# Altium schematic sheet Communication.SchDoc
size A; SheetNumber: 4; SheetTotal: 5; SPICEModelCacheJQVSSVKU: <root> / <DocumentId>JQVSSVKU</DocumentId> / </root>
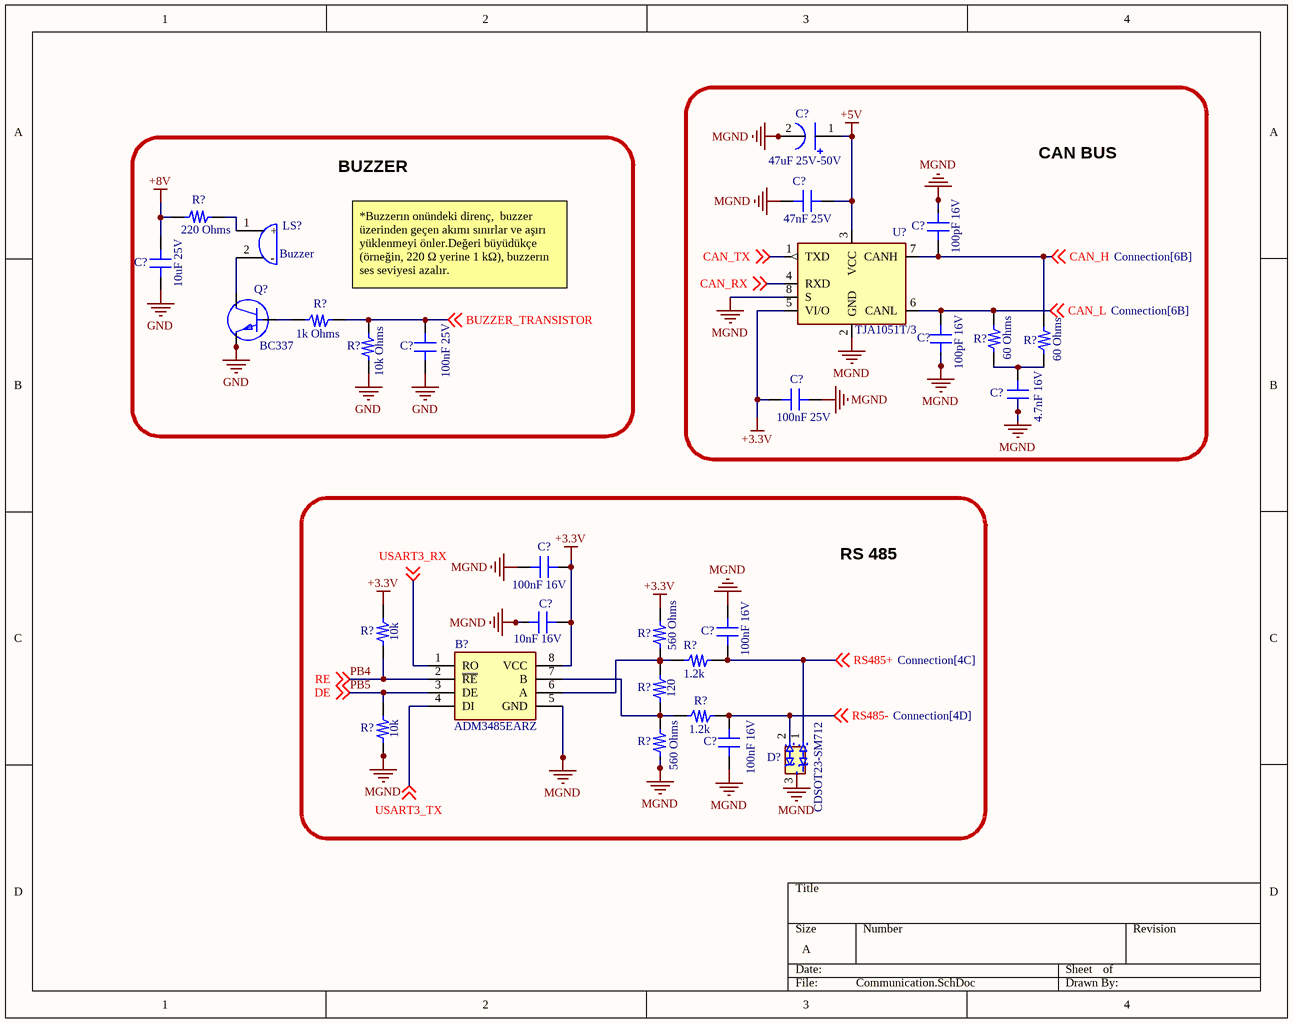
[diagram p0: Communication.SchDoc]

## Parts
(Parts that share a designator on the sheet are numbered #1, #2 ... from top to bottom, then left to right.)
B?  ADM3485EARZ  [SOIC127P600X175-8N]
C?#1  47uF 25V-50V  [Cap 18uF 63V]
C?#2  47nF 25V  [0603_CAP]
C?#3  100pF 16V  [0603_CAP]
C?#4  10uF 25V  [0805_CAP]
C?#5  100pF 16V  [0603_CAP]
C?#6  100nF 25V  [0603_CAP]
C?#7  4.7nF 16V  [0603_CAP]
C?#8  100nF 25V  [0603_CAP]
C?#9  100nF 16V  [0603_CAP]
C?#10  100nF 16V  [0603_CAP]
C?#11  10nF 16V  [0603_CAP]
C?#12  100nF 16V  [0603_CAP]
D?  CDSOT23-SM712  [SOT95P230X117-3N]
LS?  Buzzer  [Buzzer 300Mil Pitch]
Q?  BC337  [TO-92R]
R?#1  220 Ohms  [0805_RES]
R?#2  60 Ohms  [0603_RES]
R?#3  60 Ohms  [0603_RES]
R?#4  1k Ohms  [0805_RES]
R?#5  10k Ohms  [0805_RES]
R?#6  10k  [0603_RES]
R?#7  560 Ohms  [0603_RES]
R?#8  1.2k  [0603_RES]
R?#9  120  [0603_RES]
R?#10  1.2k  [0603_RES]
R?#11  10k  [0603_RES]
R?#12  560 Ohms  [0603_RES]
U?  TJA1051T/3  [SOT96-1]

## Blocks framed on the sheet
CAN BUS: C?#1-C?#3 C?#5 C?#7 C?#8 R?#2 R?#3 U?
BUZZER: C?#4 C?#6 LS? Q? R?#1 R?#4 R?#5
RS 485: B? C?#9-C?#12 D? R?#6-R?#12

## Nets
+3.3V: B?.8(VCC) C?#8.2 C?#9.1 C?#11.1 R?#6.2 R?#7.2 U?.5(VI/O)
+5V: C?#1.1 C?#2.2 U?.3(VCC)
+8V: C?#4.2 R?#1.1
GND: C?#4.1 C?#6.2 Q?.1(E) R?#5.1
MGND: B?.5(GND) C?#1.2 C?#2.1 C?#3.2 C?#5.2 C?#7.2 C?#8.1 C?#9.2 C?#10.1 C?#11.2 C?#12.2 D?.3 R?#11.1 R?#12.1 U?.2(GND) U?.8(S)
BUZZER_TRANSISTOR: C?#6.1 R?#4.1 R?#5.2 ; off-sheet BUZZER_TRANSISTOR
CAN_H: C?#3.1 R?#3.1 U?.7(CANH) ; off-sheet CAN_H
CAN_L: C?#5.1 R?#2.1 U?.6(CANL) ; off-sheet CAN_L
CAN_RX: U?.4(RXD) ; off-sheet CAN_RX
CAN_TX: U?.1(TXD) ; off-sheet CAN_TX
PB4: B?.2(~{RE}) R?#6.1 ; off-sheet RE  [also labelled RE]
PB5: B?.3(DE) R?#11.2 ; off-sheet DE  [also labelled DE]
RS485+: C?#10.2 D?.1 R?#8.1 ; off-sheet RS485+
RS485-: C?#12.1 D?.2 R?#10.1 ; off-sheet RS485-
USART3_RX: B?.1(RO) ; off-sheet USART3_RX
USART3_TX: B?.4(DI) ; off-sheet USART3_TX
NetB?_6: B?.6(A) R?#7.1 R?#8.2 R?#9.2
NetB?_7: B?.7(B) R?#9.1 R?#10.2 R?#12.2
NetC?#7_1: C?#7.1 R?#2.2 R?#3.2
NetLS?_1: LS?.1(+) R?#1.2
NetLS?_2: LS?.2(-) Q?.3(C)
NetQ?_2: Q?.2(B) R?#4.2

## Notes on the sheet
- (near R?#4) *Buzzerın onündeki direnç,  buzzer üzerinden geçen akımı sınırlar ve aşırı yüklenmeyi önler.Değeri büyüdükçe (örneğin, 220 Ω yerine 1 kΩ), buzzerın ses seviyesi azalır.

## Library data of the parts
B? = ADM485ARZ-REEL: RS-422/RS-485 Interface IC RS-485 I/F TRANSCEIVER; Manufacturer_Name: Analog Devices; Geometry.Height: 1.75mm; Manufacturer_Part_Number: ADM485ARZ-REEL; Mouser Part Number: 584-ADM485ARZ-R; Mouser Price/Stock: https://www.mouser.co.uk/ProductDetail/Analog-Devices/ADM485ARZ-REEL?qs=BpaRKvA4VqEQkRKEKZjbCg%3D%3D; Arrow Part Number: ADM485ARZ-REEL; Arrow Price/Stock: https://www.arrow.com/en/products/adm485arz-reel/analog-devices?region=nac; Datasheet Link: https://www.analog.com/media/en/technical-documentation/data-sheets/adm485.pdf
C?#1 = Capacitor_1: 10uF 63V
C?#2 C?#3 C?#5-C?#8 = CAP_0603: CL10B105KO8NNNC - MLCC (1608) 0603 1uF 16VDC ±10% X7R; Value: 100nF 16V
C?#4 = CAP_0805: Value: 100nF 16V
C?#9-C?#12 = CAP_0603: CL10B105KO8NNNC - MLCC (1608) 0603 1uF 16VDC ±10% X7R; Value: 1uF 16V
D? = CDSOT23-SM712: CDSOT23-SM712 Dual Bi-Directional TVS Diode 400W 3-Pin SOT-23 | Bourns CDSOT23-SM712; SnapEDA_Link: https://www.snapeda.com/parts/CDSOT23-SM712/Bourns/view-part/?ref=snap; Package: SOT-23 Bourns; Value: *; MF: Bourns; MP: CDSOT23-SM712; Check_prices: https://www.snapeda.com/parts/CDSOT23-SM712/Bourns/view-part/?ref=eda
LS? = Buzzer: 300mil DIP
Q? = BC337: Bipolar (BJT) Transistor NPN 45V 800mA 100MHz 625mW Through Hole TO-92-3; MF: ON Semiconductor; Availability: Unavailable; Package: TO-92 ON Semiconductor; MP: BC337; SnapEDA_Link: https://www.snapeda.com/parts/BC337/ON%20Semiconductor/view-part/2772334/?ref=snap; Value: *; Price: None
R?#1 R?#5 = RES_0805: 0805; Value: 1k Ohms; Power: 1/8 W
R?#2 R?#3 = 1k Ohms
R?#4 = RES_0805: 0805; Power: 1/8 W; Value: 1k Ohms
R?#6-R?#12 = RES_0603: 0603; Value: 0/10 Ohms; Power: 1/8W
U? = TJA1051T/3: 1/1 ÐŸÑ€Ð¸ÐµÐ¼Ð¾Ð¿ÐµÑ€ÐµÐ´Ð°Ñ‚Ñ‡Ð¸Ðº ÐŸÐ¾Ð»Ð¾Ð²Ð¸Ð½Ð° CANbus 8-SO; MF: NXP USA; Price: None; Availability: In Stock; Purchase-URL: https://pricing.snapeda.com/search/part/TJA1051T/3/?ref=eda; SnapEDA_Link: https://www.snapeda.com/parts/TJA1051T/3/NXP+USA+Inc./view-part/?ref=snap; MP: TJA1051T/3; Value: *; Check_prices: https://www.snapeda.com/parts/TJA1051T/3/NXP+USA+Inc./view-part/?ref=eda; Package: SO-8 NXP Semiconductors